# EAGLE design XL4432-SMT4 (EAGLE 6.4)
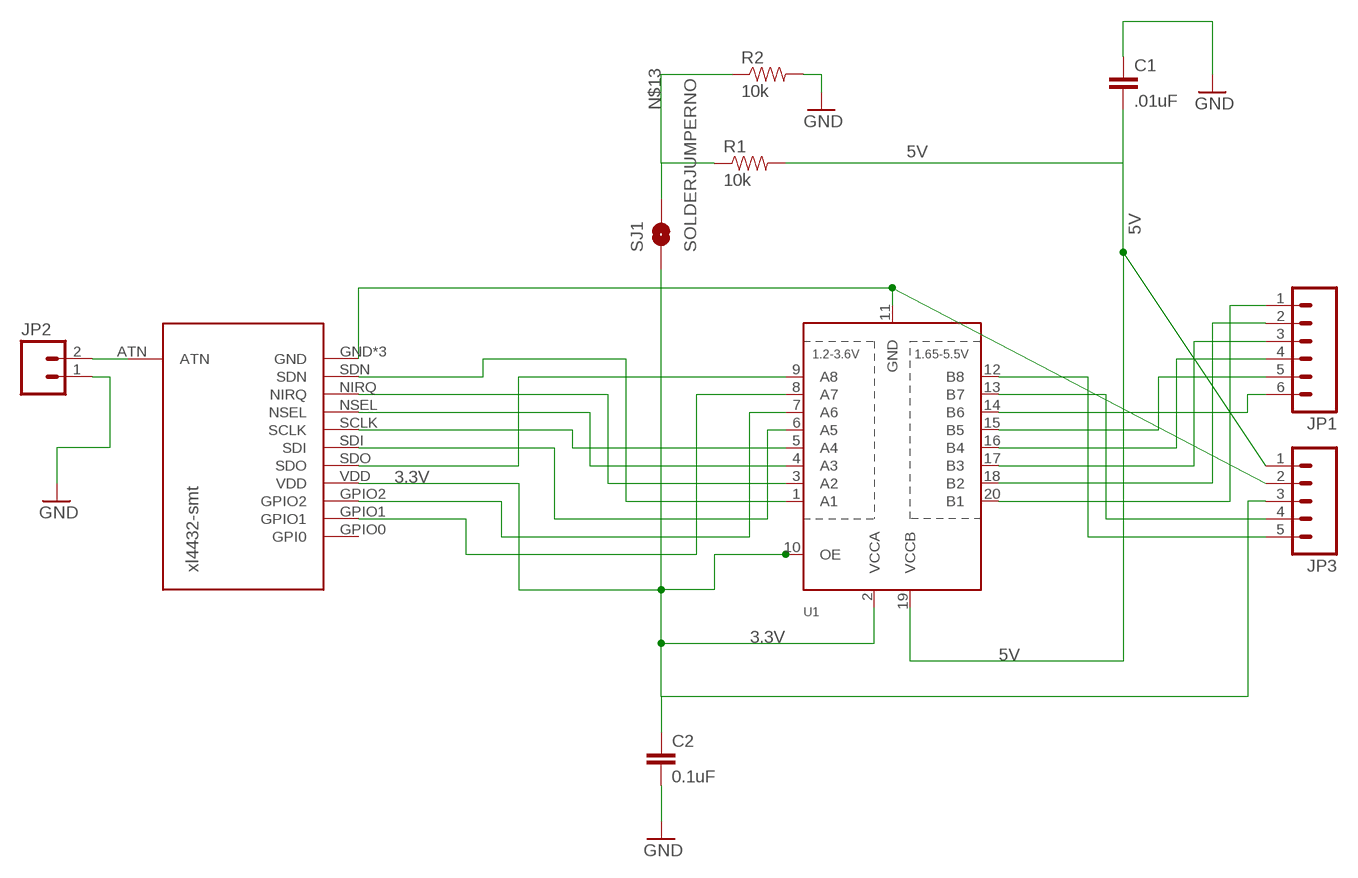
[diagram p0: schematic, sheet 1]

## Parts
C1  .01uF  CAP0805  [0805]
C2  0.1uF  CAP0805  [0805]
JP1  M06LOCK  [1X06_LOCK]
JP2  M02LOCK  [1X02_LOCK]
JP3  M05LOCK  [1X05_LOCK]
R1  10k  RESISTOR0805-RES  [0805]
R2  10k  RESISTOR0805-RES  [0805]
SJ1  SOLDERJUMPERNO  [SJ_2S-NO]
U1  TXB0108PWR  [TSSOP20]
U$1  XL4432-SMT  [XL4432-SMT]

## Nets
3.3V: C2.1 JP3.3 SJ1.1 U1.2(VCCA) U1.10(OE) U$1.VDD
5V: C1.2 JP3.1 R1.2 U1.19(VCCB)
GND: C1.1 C2.2 JP2.1 JP3.2 R2.2 U1.11(GND) U$1.GND U$1.GND1(GND) U$1.GND3(GND)
H-SDN: JP1.1 U1.20(B1)
L-SDN: U1.1(A1) U$1.SDN
N$2: U1.9(A8) U$1.SDO
N$5: U1.3(A2) U$1.NIRQ
N$6: U1.4(A3) U$1.NSEL
N$7: U1.5(A4) U$1.SCLK
N$8: U1.6(A5) U$1.SDI
N$9: U1.7(A6) U$1.GPIO2
N$10: U1.8(A7) U$1.GPIO1
N$11: JP1.2 U1.18(B2)
N$12: JP2.2 U$1.ATN
N$13: R1.1 R2.1 SJ1.2
N$14: JP1.3 U1.17(B3)
N$15: JP1.4 U1.16(B4)
N$16: JP1.5 U1.15(B5)
N$17: JP1.6 U1.14(B6)
N$18: JP3.4 U1.13(B7)
N$19: JP3.5 U1.12(B8)
Unconnected: U$1.GPIO0(GPI0)

## Library data of the parts
C1 C2 = SparkFun:CAP: Capacitor Standard 0603 ceramic capacitor, and 0.1" leaded capacitor.
JP1 = SparkFun:M06: Header 6 Standard 6-pin 0.1" header. Use with straight break away headers (SKU : PRT-00116), right angle break away headers (PRT-00553), swiss pins (PRT-00743), machine pins (PRT-00117), and female headers (PRT-00115). Molex polarized connector foot print use with SKU : PRT-08094 with associated crimp pins and housings. NOTES ON THE VARIANTS LOCK and LOCK_LONGPADS... This footprint was designed to help hold the alignment of a through-hole component (i.e. 6-pin header) while soldering it into place. You may notice that each hole has been shifted either up or down by 0.005 of an inch from it's more standard position (which is a perfectly straight line). This slight alteration caused the pins (the squares in the middle) to touch the edges of the holes. Because they are alternating, it causes a "brace" to hold the component in place. 0.005 has proven to be the perfect amount of "off-center" position when using our standard breakaway headers. Although looks a little odd when you look at the bare footprint, once you have a header in there, the alteration is very hard to notice. Also, if you push a header all the way into place, it is covered up entirely on the bottom side. This idea of altering the position of holes to aid alignment will be further integrated into the Sparkfun Library for other footprints. It can help hold any component with 3 or more connection pins.
JP2 = SparkFun:M02: Header 2 Standard 2-pin 0.1" header. Use with straight break away headers (SKU : PRT-00116), right angle break away headers (PRT-00553), swiss pins (PRT-00743), machine pins (PRT-00117), and female headers (PRT-00115). Molex polarized connector foot print use with SKU : PRT-08233 with associated crimp pins and housings.
JP3 = SparkFun:M05: Header 5 Standard 5-pin 0.1" header. Use with straight break away headers (SKU : PRT-00116), right angle break away headers (PRT-00553), swiss pins (PRT-00743), machine pins (PRT-00117), and female headers (PRT-00115). Molex polarized connector foot print use with SKU : PRT-08230 with associated crimp pins and housings.
R1 R2 = SparkFun:RESISTOR: Resistor Basic schematic elements and footprints for 0603, 1206, and PTH resistors.
SJ1 = SparkFun:SOLDERJUMPER: Solder Jumper Standard SMD solder jumper. Used to automate production. Two varients : Normally Open and Normally Closed are the same, but have different paste layers. NC will have a large amount of paste and should jumper during reflow.
U1 = microbuilder:TXB0108PWR: 8-Bit Bi-Directional Level Shifter 1.2V-3.6V (VCCA) to 1.65V-5.5V (VCCB) bi-directional level shifter with auto direction sensing. Max data rate - VCCA 1.8V: 20Mbps (50ns), VCCA 3.3V: 100Mbps (10ns) Digikey: 296-21527-1-ND
U$1 = Random parts:XL4432-SMT

## Board
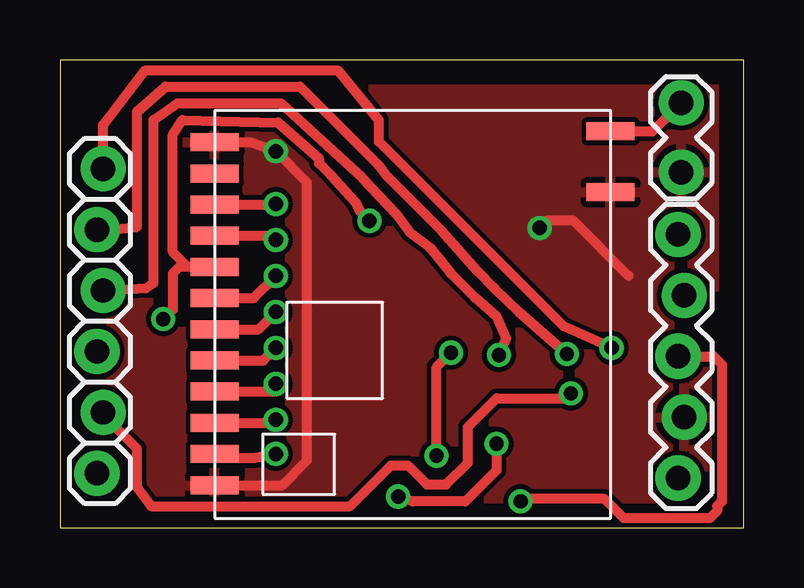
[diagram p1: board, top side]
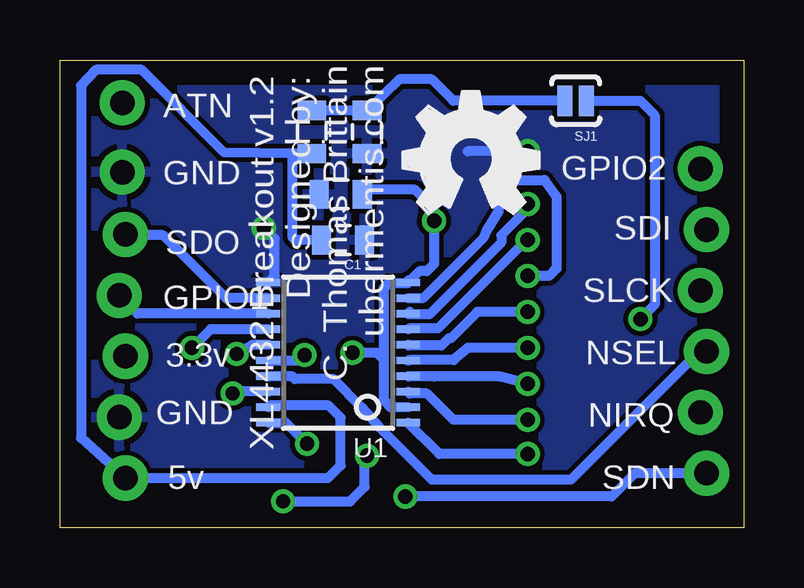
[diagram p2: board, bottom side, seen from below]

Size 28.5 x 19.5 mm. Coordinates in mm from the lower left corner, seen from the top.
Outline: 0,0 28.5,0 28.5,19.5 0,19.5 0,0
Copper layers (1*16): Top 0.035mm / dielectric 1.5mm / Bottom 0.035mm
Design rules "default": minimum track width 10mil, minimum drill 24mil, track to track 8mil, track to pad 8mil, pad to pad 8mil, via to via 8mil, smd to smd 8mil, copper to edge 40mil, drill to drill 8mil, minimum pad ring 10mil, minimum via ring 8mil, stop-mask expansion 4mil, vias tented up to drill 0mil, thermal gap 10mil

### Footprints (pad centres in the part's own frame; a part is rotated, then mirrored left to right if it is on the bottom)
0805 = smd 0.8 x 1.2: 1 -0.9,0; 2 0.9,0
1X06_LOCK = drill 1.016 pad 1.88: 1 0,0; 2 2.54,-0.254; 3 5.08,0; 4 7.62,-0.254; 5 10.16,0; 6 12.7,-0.254
1X02_LOCK = drill 1.016 pad 1.88: 1 -0.178,0; 2 2.718,0
1X05_LOCK = drill 1.016 pad 1.88: 1 0,0.127; 2 2.54,-0.127; 3 5.08,0.127; 4 7.62,-0.127; 5 10.16,0.127
SJ_2S-NO = smd 0.635 x 1.27: 1 -0.45,0; 2 0.45,0
TSSOP20 = smd 0.305 x 0.991: 1 -2.925,-2.918; 2 -2.275,-2.918; 3 -1.625,-2.918; 4 -0.975,-2.918; 5 -0.325,-2.918; 6 0.325,-2.918; 7 0.975,-2.918; 8 1.625,-2.918; 9 2.275,-2.918; 10 2.925,-2.918; 11 2.925,2.918; 12 2.275,2.918; 13 1.625,2.918; 14 0.975,2.918; 15 0.325,2.918; 16 -0.325,2.918; 17 -0.975,2.918; 18 -1.625,2.918; 19 -2.275,2.918; 20 -2.925,2.918
XL4432-SMT = smd 2 x 0.75: ATN 16.5,16.134; GND 0,15.675; GND1 0,1.375; GND3 16.5,13.594; GPIO0 0,14.375; GPIO1 0,13.075; GPIO2 0,11.775; NIRQ 0,3.975; NSEL 0,5.275; SCLK 0,6.575; SDI 0,7.875; SDN 0,2.675; SDO 0,9.175; VDD 0,10.475

### Placement (x,y rotation side)
C1  16.7,12 180 bottom
C2  16.8,13.9 180 bottom
JP1  1.54,2.27 90 top
JP2  25.9,15 90 top
JP3  25.9,2.07 90 top
R1  18,16.5 270 bottom
R2  15.7,16.5 270 bottom
SJ1  7,17.8 180 bottom
U1  16.9,7.3 90 bottom
U$1  6.45,0.4 0 top
U$3  [OSHW_FILLX200_NOTEXT]  14.2,13.1 0 bottom

### Tracks (layer width: path | path; a pad name or v marks a point on that pad's centre or on a via)
3.3V  (via drill 0.6)
  Top 0.406: U$1.VDD 5.33,10.88 | 5.33,10.88 4.7,11.5 4.7,16.4 5.1,17 9.1,16.9 10.8,15.4 10.8,15.2 11.3,14.7 12.3,13.6 12.5,13.2 v12.9,12.8 | 5.33,10.88 4.97,10.88 4.7,10.6 4.7,9.1 v4.3,8.7 | v19.2,1.1 19.3,1.2 22.7,1.2 23.5,0.4 27.1,0.4 27.4,0.7 27.4,0.9 27.6,1.1 27.6,6.8 27.25,7.15 JP3.3 | v15.7,3 15.7,6.7 v16.3,7.3
  Bottom 0.406: U1.10 13.98,10.32 | U1.2 14.72,5.03 15,5.3 15,7 | 15,7 15,10 14.8,10.2 14.01,10.2 U1.10 | U1.10 13.51,10.7 13.2,10.7 12.9,11 v12.9,12.8 13,13.1 13,13.4 13.7,14.1 15.7,14.1 C2.1 | SJ1.1 4.3,17.8 3.7,17.2 3.7,9.3 v4.3,8.7 | v19.2,1.1 16.4,1.1 15.8,1.7 15.8,2.9 v15.7,3 | v16.3,7.3 15.3,7.3 15,7
5V
  Bottom 0.406: U1.19 19.74,5.1 17.3,5.1 16.8,4.6 16.8,2.6 17.33,2.07 JP3.1 27.62,3.74 27.62,18.44 27,19.1 25.1,19.1 21.65,15.65 18.7,15.61 | R1.2 18.7,15.61 | C1.2 18.7,12 18.8,12.1 18.8,15.51 18.7,15.61
GND  (via drill 0.6)
  Top 0.406: U$1.GND 7.92,16.07 v9,15.7 10.3,14.4 10.3,2.8 9.28,1.77 U$1.GND1 | 23.7,10.5 21.4,12.8 20.3,12.8 v20,12.5
  Bottom 0.406: v9,15.7 11.5,15.7 | U1.11 19.54,10.5 19.54,12.04 v20,12.5
  pour Bottom: -0.5,0 29,0 29,20 -0.5,20
  pour Top: -0.5,20 -0.5,0 29,0 29,20
H-SDN  (via drill 0.6)
  Top 0.406: v18.2,3.5 18.2,2.4 16.9,1.1 14.7,1.1 v14.1,1.3
  Bottom 0.406: U1.20 19.07,4.38 v18.2,3.5 | JP1.1 4.53,2.27 5.5,1.3 v14.1,1.3
L-SDN  (via drill 0.6)
  Top 0.406: v9,3.08 8.1,2.9 6.62,2.9 U$1.SDN
  Bottom 0.406: v9,3.08 12.68,3.08 U1.1
N$2  (via drill 0.6)
  Top 0.406: U$1.SDO 8.07,9.57 v9,10.5
  Bottom 0.406: U1.9 13.35,9.59 10.83,12.11 10.7,12.4 10.2,13.2 10.2,14.2 9.8,14.5 8.3,14.5 7.8,13.8 7.8,10.8 8.1,10.5 v9,10.5
N$5  (via drill 0.6)
  Top 0.406: U$1.NIRQ 9,4.38 v9,4.5
  Bottom 0.406: v9,4.5 12.1,4.5 13.2,5.6 13.91,5.6 U1.3
N$6  (via drill 0.6)
  Top 0.406: U$1.NSEL 9,5.67 v9,6
  Bottom 0.406: v9,6 10.17,6.3 12.9,6.3 13.96,6.3 U1.4
N$7  (via drill 0.6)
  Top 0.406: U$1.SCLK 8.47,6.97 v9,7.5
  Bottom 0.406: v9,7.5 11.5,7.5 12.09,6.99 13.9,6.99 U1.5
N$8  (via drill 0.6)
  Top 0.406: U$1.SDI 8.28,8.28 v9,9
  Bottom 0.406: v9,9 11.1,9 12.2,7.9 12.3,7.9 12.6,7.6 13.96,7.6 U1.6
N$9  (via drill 0.6)
  Top 0.406: U$1.GPIO2 8.82,12.18 v9,12
  Bottom 0.406: v9,12 9.04,12.01 12.74,8.31 13.96,8.3 U1.7
N$10  (via drill 0.6)
  Top 0.406: U$1.GPIO1 8.97,13.47 v9,13.5
  Bottom 0.406: 13.91,9 U1.8 13.96,8.9 13.1,8.9 10.1,11.9 10.1,12.2 9,13.3 v9,13.5
N$11  (via drill 0.6)
  Top 0.406: JP1.2 1.79,4.71 3.2,3.3 3.2,1.7 3.8,0.9 12.1,0.9 13.8,2.6 14.5,2.6 15.3,1.8 16.1,1.8 17,2.7 17,4.2 18.2,5.4 21,5.4 v21.3,5.6
  Bottom 0.406: U1.18 21.12,5.67 21.2,5.6 v21.3,5.6
N$12
  Top 0.406: U$1.ATN 24.72,16.53 JP2.2
N$13
  Bottom 0.406: R1.1 R2.1 14.35,18.7 13,18.7 12.1,17.8 SJ1.2
N$14
  Bottom 0.406: JP1.3 1.85,7.35 7.2,2 13,2 15.2,4.2 15.9,5 17.1,6.2 18.7,6.2 18.8,6.3 19.79,6.3 U1.17
N$15  (via drill 0.6)
  Top 0.406: JP1.4 3.59,9.99 3.9,10.2 3.9,17 4.9,17.7 9.2,17.7 12.6,14.6 14,13.1 14.6,12.3 15.4,11.7 16.3,10.6 17.3,9.6 18.2,8.8 18.6,7.9 v18.3,7.2
  Bottom 0.406: U1.16 18.52,6.97 v18.3,7.2
N$16  (via drill 0.6)
  Top 0.406: JP1.5 2.13,12.43 3.21,12.54 3.21,17.34 4.4,18.4 10,18.4 13.3,15.1 13.6,14.7 15.9,12.4 17.4,10.7 18.1,10 19.14,9 20.84,7.5 v21.14,7.25
  Bottom 0.406: U1.15 20.48,7.62 v21.14,7.25
N$17  (via drill 0.6)
  Top 0.406: JP1.6 1.79,16.79 3.52,19.05 11.62,19.05 13.3,17 13.3,16.1 21,8.4 v23,7.5
  Bottom 0.406: U1.14 22.23,8.28 v23,7.5
N$18
  Bottom 0.406: U1.13 25.26,8.93 JP3.4
N$19
  Bottom 0.406: U1.12 21.57,9.57 24.2,12.2 25.74,12.2 JP3.5

### Text on the board
_bsilk: XL4432 Breakout v1.2 / Designed by: / C. Thomas Brittain / ubermentis.com | ATN | GPIO2 | GND | SDI | SDO | SLCK | GPIO1 | NSEL | 3.3v | NIRQ | GND | SDN | 5v